# EAGLE design InterfaceUSB6TVSBoard (EAGLE 7.5.0)
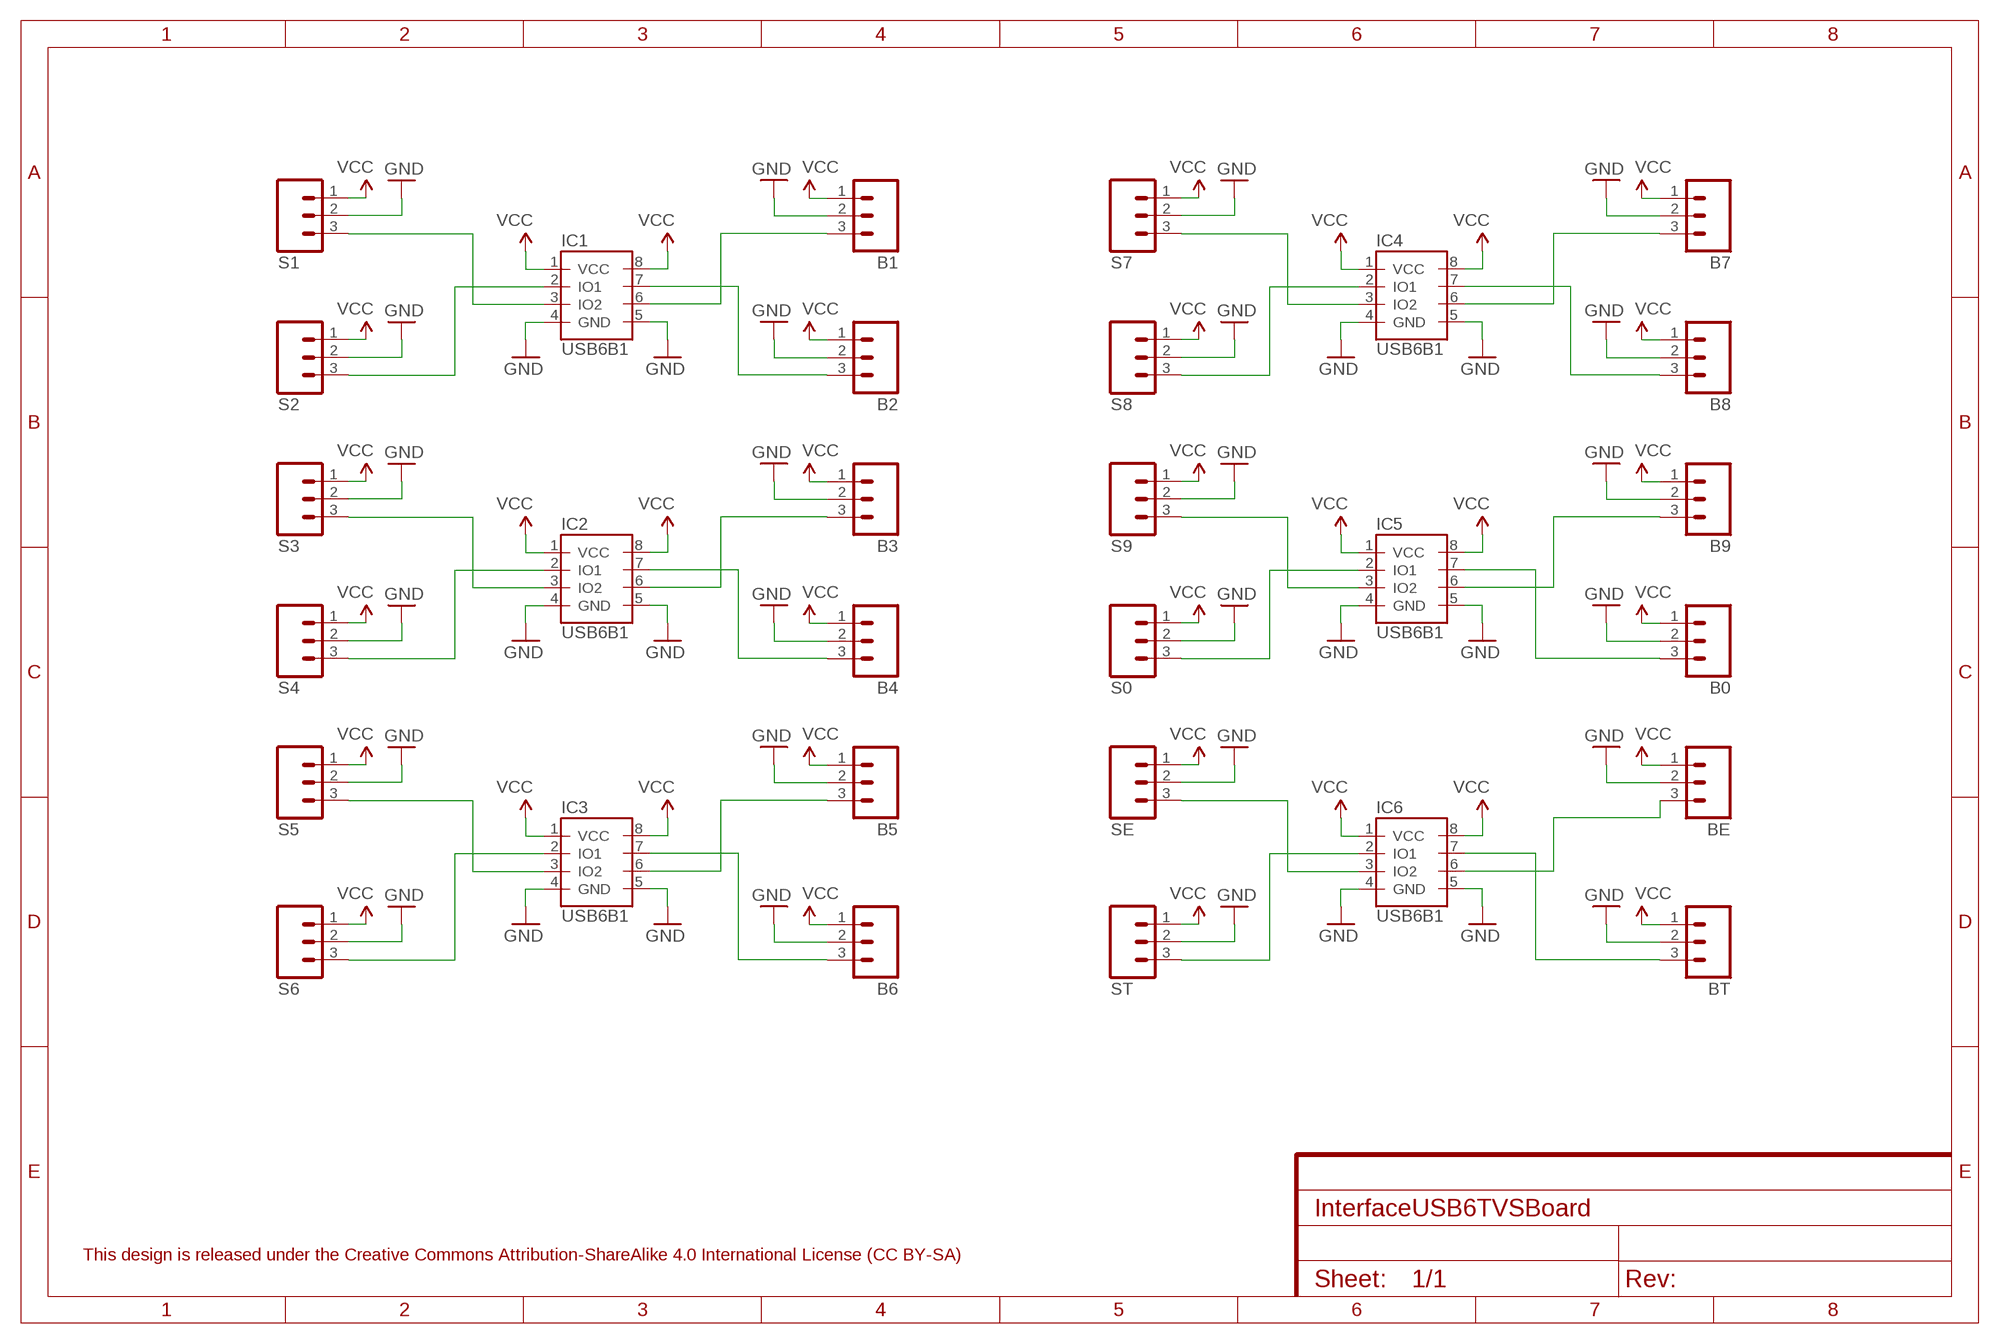
[diagram p0: schematic, sheet 1]
FRAME1 (FRAME-A4L): CNAME: Simulator Interface TVS Board; CREVISION: A 04/2016; DESIGNER: A J Instone-Cowie

## Parts
B0  M03PTH  [1X03]
B1  M03PTH  [1X03]
B2  M03PTH  [1X03]
B3  M03PTH  [1X03]
B4  M03PTH  [1X03]
B5  M03PTH  [1X03]
B6  M03PTH  [1X03]
B7  M03PTH  [1X03]
B8  M03PTH  [1X03]
B9  M03PTH  [1X03]
BE  M03PTH  [1X03]
BT  M03PTH  [1X03]
IC1  USB6B1  [SO08]
IC2  USB6B1  [SO08]
IC3  USB6B1  [SO08]
IC4  USB6B1  [SO08]
IC5  USB6B1  [SO08]
IC6  USB6B1  [SO08]
S0  M03PTH  [1X03]
S1  M03PTH  [1X03]
S2  M03PTH  [1X03]
S3  M03PTH  [1X03]
S4  M03PTH  [1X03]
S5  M03PTH  [1X03]
S6  M03PTH  [1X03]
S7  M03PTH  [1X03]
S8  M03PTH  [1X03]
S9  M03PTH  [1X03]
SE  M03PTH  [1X03]
ST  M03PTH  [1X03]

## Nets
GND: B0.2 B1.2 B2.2 B3.2 B4.2 B5.2 B6.2 B7.2 B8.2 B9.2 BE.2 BT.2 IC1.4(GND) IC1.5(GND) IC2.4(GND) IC2.5(GND) IC3.4(GND) IC3.5(GND) IC4.4(GND) IC4.5(GND) IC5.4(GND) IC5.5(GND) IC6.4(GND) IC6.5(GND) S0.2 S1.2 S2.2 S3.2 S4.2 S5.2 S6.2 S7.2 S8.2 S9.2 SE.2 ST.2
N$1: IC1.3(IO2) S1.3
N$2: IC1.2(IO1) S2.3
N$3: B1.3 IC1.6(IO2)
N$4: B2.3 IC1.7(IO1)
N$5: IC2.3(IO2) S3.3
N$6: B3.3 IC2.6(IO2)
N$7: IC2.2(IO1) S4.3
N$8: B4.3 IC2.7(IO1)
N$9: IC3.3(IO2) S5.3
N$10: B5.3 IC3.6(IO2)
N$11: IC3.2(IO1) S6.3
N$12: B6.3 IC3.7(IO1)
N$13: IC4.3(IO2) S7.3
N$14: IC4.2(IO1) S8.3
N$15: IC5.3(IO2) S9.3
N$16: B9.3 IC5.6(IO2)
N$18: IC6.3(IO2) SE.3
N$19: BE.3 IC6.6(IO2)
N$20: B8.3 IC4.7(IO1)
N$21: B7.3 IC4.6(IO2)
N$22: IC6.2(IO1) ST.3
N$23: BT.3 IC6.7(IO1)
N$24: IC5.2(IO1) S0.3
N$25: B0.3 IC5.7(IO1)
VCC: B0.1 B1.1 B2.1 B3.1 B4.1 B5.1 B6.1 B7.1 B8.1 B9.1 BE.1 BT.1 IC1.1(VCC) IC1.8(VCC) IC2.1(VCC) IC2.8(VCC) IC3.1(VCC) IC3.8(VCC) IC4.1(VCC) IC4.8(VCC) IC5.1(VCC) IC5.8(VCC) IC6.1(VCC) IC6.8(VCC) S0.1 S1.1 S2.1 S3.1 S4.1 S5.1 S6.1 S7.1 S8.1 S9.1 SE.1 ST.1

## Notes on the sheet
- This design is released under the Creative Commons Attribution-ShareAlike 4.0 International License (CC BY-SA)

## Library data of the parts
B0 B1-B9 BE BT S0 S1-S9 SE ST = SparkFun-Connectors:M03: Header 3 Standard 3-pin 0.1" header. Use with straight break away headers (SKU : PRT-00116), right angle break away headers (PRT-00553), swiss pins (PRT-00743), machine pins (PRT-00117), and female headers (PRT-00115). Molex polarized connector foot print use with SKU : PRT-08232 with associated crimp pins and housings.
IC1-IC6 = st-microelectronics:USB6B1: DATA LINES PROTECTION Source: http://www.st.com/stonline/products/literature/ds/5605.pdf; MPN: USB6B1; OC_FARNELL: 9804358; OC_NEWARK: 26M4750

## Board
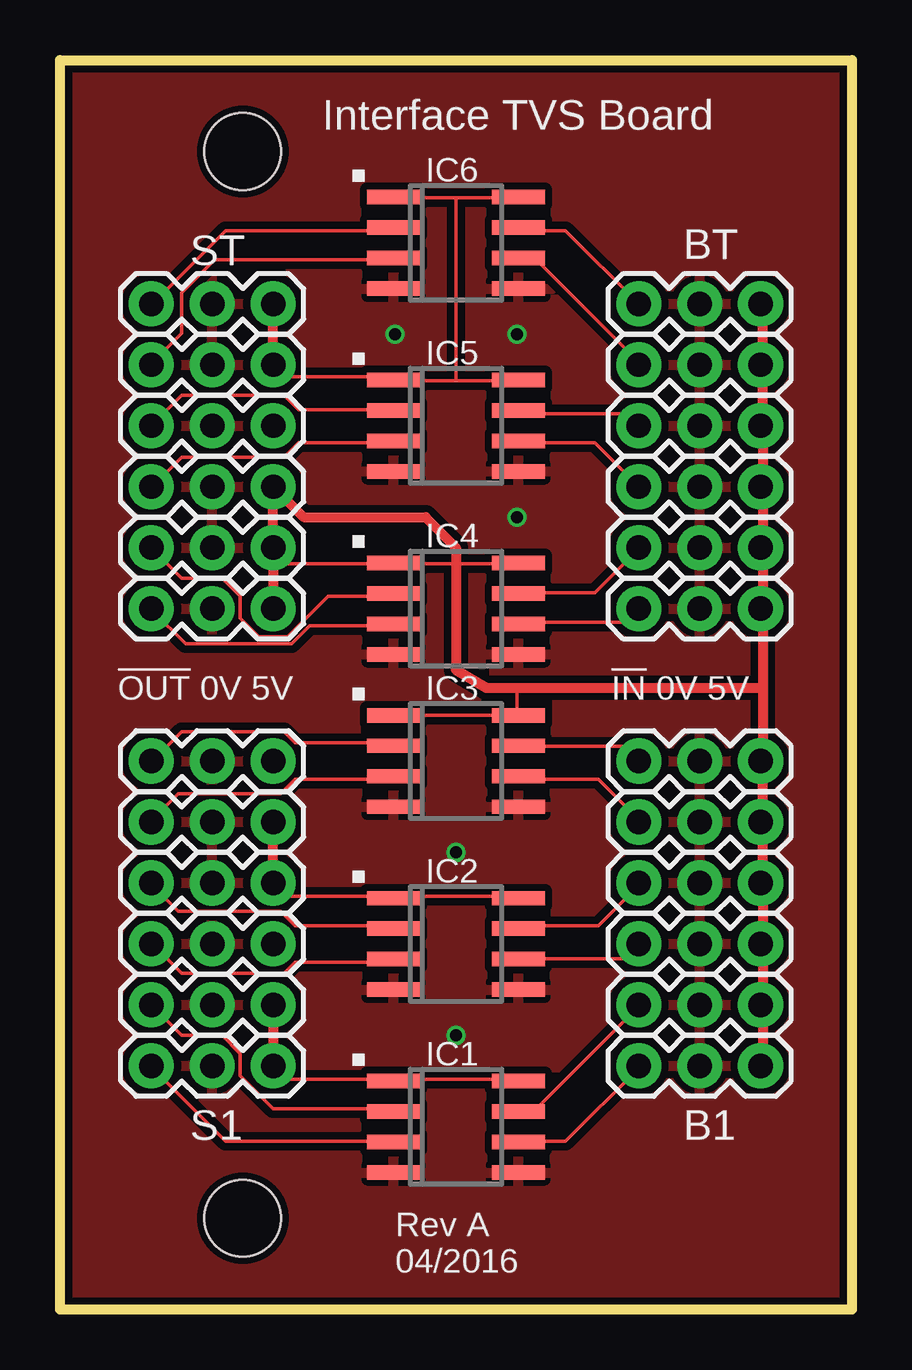
[diagram p1: board, top side]
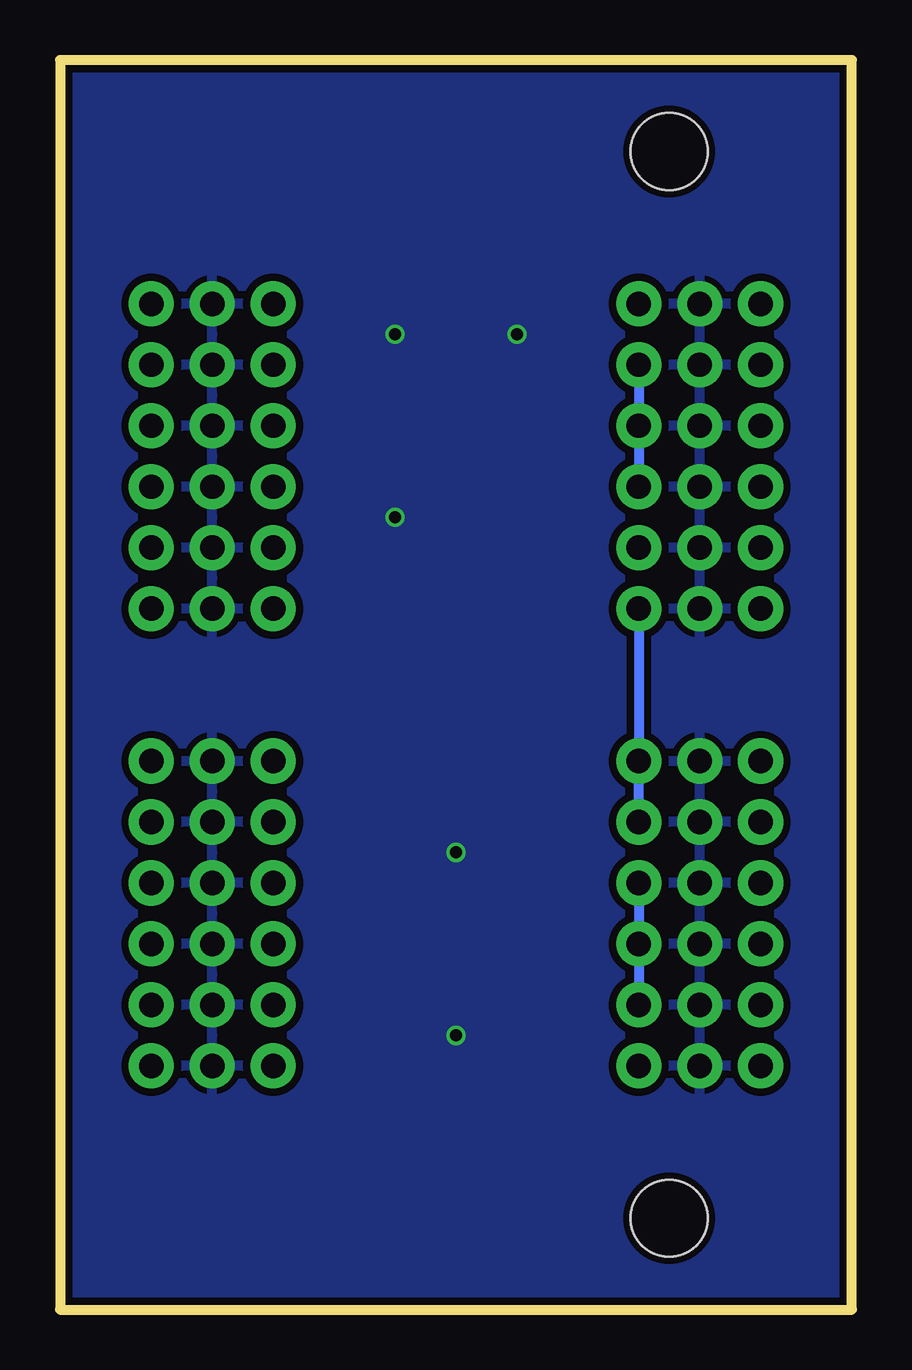
[diagram p2: board, bottom side, seen from below]

Size 33.02 x 52.07 mm. Coordinates in mm from the lower left corner, seen from the top.
Outline: 0,52.07 33.02,52.07 33.02,0 0,0 0,52.07
Copper layers (1*16): Top 0.035mm / dielectric 1.5mm / Bottom 0.035mm
Design rules "SeeedStudio_2layer_DRU_no_angle_20140221": minimum track width 6mil, minimum drill 12mil, track to track 6mil, track to pad 6mil, pad to pad 6mil, via to via 6mil, smd to smd 0mil, copper to edge 10mil, drill to drill 10mil, minimum pad ring 10mil, minimum via ring 6mil, stop-mask expansion 2mil, vias tented up to drill 100mil, thermal gap 10mil
Holes 3.2 mm at 7.62,3.81 7.62,48.26

### Footprints (pad centres in the part's own frame; a part is rotated, then mirrored left to right if it is on the bottom)
1X03 = drill 1.016 pad 1.88: 1 0,0; 2 2.54,0; 3 5.08,0
SO08 = smd 0.6 x 2.2: 1 -1.905,-2.6; 2 -0.635,-2.6; 3 0.635,-2.6; 4 1.905,-2.6; 5 1.905,2.6; 6 0.635,2.6; 7 -0.635,2.6; 8 -1.905,2.6

### Placement (x,y rotation side)
B0  29.21,36.83 180 top
B1  29.21,10.16 180 top
B2  29.21,12.7 180 top
B3  29.21,15.24 180 top
B4  29.21,17.78 180 top
B5  29.21,20.32 180 top
B6  29.21,22.86 180 top
B7  29.21,29.21 180 top
B8  29.21,31.75 180 top
B9  29.21,34.29 180 top
BE  29.21,39.37 180 top
BT  29.21,41.91 180 top
IC1  16.51,7.62 270 top
IC2  16.51,15.24 270 top
IC3  16.51,22.86 270 top
IC4  16.51,29.21 270 top
IC5  16.51,36.83 270 top
IC6  16.51,44.45 270 top
S0  8.89,36.83 180 top
S1  8.89,10.16 180 top
S2  8.89,12.7 180 top
S3  8.89,15.24 180 top
S4  8.89,17.78 180 top
S5  8.89,20.32 180 top
S6  8.89,22.86 180 top
S7  8.89,29.21 180 top
S8  8.89,31.75 180 top
S9  8.89,34.29 180 top
SE  8.89,39.37 180 top
ST  8.89,41.91 180 top

### Tracks (layer width: path | path; a pad name or v marks a point on that pad's centre or on a via)
GND  (via drill 0.5)
  other vias: 16.51,19.05 16.51,11.43 19.05,33.02 13.97,40.64 19.05,40.64
  pour Bottom (isolate 0.305): 0,52.07 0,0 33.02,0 33.02,52.07
  pour Top (isolate 0.305): 0,52.07 0,0 33.02,0 33.02,52.07
N$1
  Top 0.152: IC1.3 13.77,7.01 6.91,7.01 3.86,10.06 S1.3
N$2
  Top 0.152: S2.3 5.08,11.43 6.76,11.43 7.52,10.67 7.52,9.75 8.89,8.38 13.77,8.38 IC1.2
N$3
  Top 0.152: IC1.6 19.25,7.01 21.08,7.01 24.13,10.06 B1.3
N$4
  Top 0.152: IC1.7 19.25,8.38 19.86,8.38 24.13,12.65 B2.3
N$5
  Top 0.152: IC2.3 13.77,14.48 9.8,14.48 9.35,14.02 5.08,14.02 3.86,15.24 S3.3
N$6
  Top 0.152: B3.3 23.52,14.63 19.25,14.63 IC2.6
N$7
  Top 0.152: IC2.2 13.77,16 9.8,16 9.2,16.61 4.93,16.61 3.86,17.68 S4.3
N$8
  Top 0.152: IC2.7 19.25,16 22.45,16 24.13,17.68 B4.3
N$9
  Top 0.152: IC3.3 13.77,22.1 9.8,22.1 9.2,21.49 4.93,21.49 3.86,20.42 S5.3
N$10
  Top 0.152: IC3.6 19.25,22.1 22.45,22.1 24.13,20.42 B5.3
N$11
  Top 0.152: IC3.2 13.77,23.62 9.8,23.62 9.35,24.08 5.08,24.08 3.86,22.86 S6.3
N$12
  Top 0.152: B6.3 23.52,23.47 19.25,23.47 IC3.7
N$13
  Top 0.152: IC4.3 13.77,28.5 10.41,28.5 9.65,27.74 5.23,27.74 3.86,29.11 S7.3
N$14
  Top 0.152: S8.3 5.08,30.48 6.76,30.48 7.52,29.72 7.52,28.8 8.28,28.04 9.5,28.04 11.18,29.72 13.77,29.72 IC4.2
N$15
  Top 0.152: IC5.3 13.77,36.12 9.96,36.12 9.35,35.51 5.08,35.51 3.86,34.29 S9.3
N$16
  Top 0.152: B9.3 22.3,36.12 19.25,36.12 IC5.6
N$18
  Top 0.152: IC6.3 13.77,43.74 6.45,43.74 5.08,42.37 5.08,40.69 3.86,39.47 SE.3
N$19
  Top 0.152: IC6.6 19.25,43.74 19.86,43.74 24.13,39.47 BE.3
N$20
  Top 0.152: IC4.7 19.25,29.87 22.3,29.87 24.13,31.7 B8.3
N$21
  Top 0.152: IC4.6 19.25,28.65 23.67,28.65 24.13,29.11 B7.3
N$22
  Top 0.152: IC6.2 13.77,44.96 6.91,44.96 3.86,41.91 ST.3
N$23
  Top 0.152: BT.3 21.08,44.96 19.25,44.96 IC6.7
N$24
  Top 0.152: S0.3 5.08,38.1 9.35,38.1 9.96,37.49 13.77,37.49 IC5.2
N$25
  Top 0.152: IC5.7 19.25,37.34 23.67,37.34 24.13,36.88 B0.3
VCC
  Top 0.152: 29.31,10.21 B1.1 | 29.31,12.65 B2.1 29.31,12.8 | 29.31,17.68 B4.1 29.31,17.83 | 29.31,20.27 B5.1 29.31,20.42 | 29.31,15.24 B3.1 | 29.31,29.26 B7.1 29.31,29.11 | 29.31,31.7 B8.1 29.31,31.85 | 29.31,36.73 B0.1 29.31,36.88 | 29.31,39.32 BE.1 29.31,39.47 | 29.31,41.91 BT.1 | 29.31,34.29 B9.1 | 29.31,22.86 B6.1 | IC1.8 19.1,9.6 13.92,9.6 IC1.1 13.77,9.6 9.35,9.6 8.89,10.06 S1.1 | IC2.8 19.1,17.22 13.92,17.22 IC2.1 13.77,17.22 9.35,17.22 8.89,17.68 S4.1 | 13.92,24.84 IC3.1 IC3.8 | 19.1,24.84 IC3.8 | IC4.8 19.1,31.09 13.92,31.09 IC4.1 13.77,31.09 8.89,31.09 | 16.51,46.33 19.1,46.33 IC6.8 | 16.51,46.33 13.92,46.33 IC6.1 | 16.51,38.71 19.1,38.71 IC5.8 | 16.51,38.71 13.92,38.71 IC5.1 13.77,38.86 9.35,38.86 8.89,39.32 SE.1 | 16.51,38.71 16.51,46.33 | 8.89,31.7 S8.1 | 19.25,24.84 IC3.8 | 19.05,24.84 19.05,25.91
  Top 0.254: 29.31,25.91 29.31,25.4 | 19.1,24.84 19.05,24.84
  Top 0.406: 29.31,12.65 29.31,10.21 | 29.31,17.68 29.31,15.24 29.31,12.8 | 29.31,17.83 29.31,20.27 | 29.31,20.42 29.31,22.86 29.31,25.4 29.31,29.11 | 29.31,31.7 29.31,29.26 | 29.31,36.73 29.31,34.29 29.31,31.85 | 29.31,36.88 29.31,39.32 | 29.31,39.47 29.31,41.91 | S2.1 S1.1 | S4.1 S5.1 | S7.1 8.89,31.09 S8.1 S9.1 10.16,33.02 15.24,33.02 16.51,31.75 16.51,26.67 17.78,25.91 19.05,25.91 29.31,25.91 | SE.1 ST.1
  Bottom 0.406: S4.1 S3.1 S2.1 | S5.1 S6.1 S7.1 | SE.1 S0.1 S9.1

### Text on the board
tPlace: Interface TVS Board | !OUT! 0V 5V | !IN! 0V 5V | Rev A / 04/2016